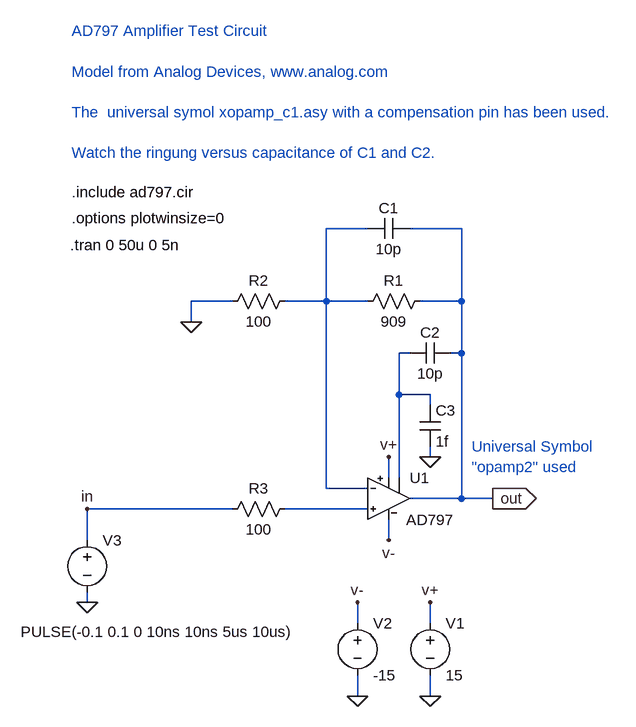
[diagram p0: schematic AD797_test.asc]
AD797_test.asc, the LTspice schematic file:
Version 4
SHEET 1 1200 1172
WIRE 96 192 32 192
WIRE 32 192 32 -96
WIRE 32 -96 96 -96
WIRE 176 -96 240 -96
WIRE 240 -96 240 -16
WIRE -112 224 -336 224
WIRE -32 -96 32 -96
WIRE -336 272 -336 224
WIRE 32 -96 32 -208
WIRE 32 -208 96 -208
WIRE 160 -208 240 -208
WIRE 240 -208 240 -96
WIRE 80 480 80 512
WIRE 128 144 128 176
WIRE 160 208 240 208
WIRE 96 224 -32 224
WIRE 240 208 288 208
WIRE 192 480 192 512
WIRE 128 240 128 272
WIRE 80 400 80 368
WIRE 192 400 192 368
WIRE -336 368 -336 352
WIRE 144 176 144 48
WIRE 144 -16 160 -16
WIRE 224 -16 240 -16
WIRE 240 -16 240 208
WIRE -176 -64 -176 -96
WIRE -176 -96 -112 -96
WIRE 192 144 192 128
WIRE 192 64 192 48
WIRE 192 48 144 48
WIRE 144 48 144 -16
FLAG 192 512 0
FLAG -176 -64 0
FLAG -336 368 0
FLAG 288 208 out
IOPIN 288 208 Out
FLAG 80 512 0
FLAG -336 224 in
FLAG 128 144 v+
FLAG 128 272 v-
FLAG 80 368 v-
FLAG 192 368 v+
FLAG 192 144 0
SYMBOL voltage 192 384 R0
WINDOW 123 0 0 Left 0
WINDOW 39 0 0 Left 0
SYMATTR InstName V1
SYMATTR Value 15
SYMBOL voltage 80 384 R0
WINDOW 123 0 0 Left 0
WINDOW 39 0 0 Left 0
SYMATTR InstName V2
SYMATTR Value -15
SYMBOL res -16 -112 R90
WINDOW 0 0 56 VBottom 0
WINDOW 3 32 56 VTop 0
SYMATTR InstName R2
SYMATTR Value 100
SYMBOL voltage -336 256 R0
WINDOW 3 -102 157 Left 0
WINDOW 123 0 0 Left 0
WINDOW 39 0 0 Left 0
SYMATTR Value PULSE(-0.1 0.1 0 10ns 10ns 5us 10us)
SYMATTR InstName V3
SYMBOL cap 160 -224 R90
WINDOW 0 0 32 VBottom 0
WINDOW 3 32 32 VTop 0
SYMATTR InstName C1
SYMATTR Value 10p
SYMBOL res 192 -112 R90
WINDOW 0 0 56 VBottom 0
WINDOW 3 32 56 VTop 0
SYMATTR InstName R1
SYMATTR Value 909
SYMBOL res -128 240 R270
WINDOW 0 32 56 VTop 0
WINDOW 3 0 56 VBottom 0
SYMATTR InstName R3
SYMATTR Value 100
SYMBOL cap 160 0 R270
WINDOW 0 32 32 VTop 0
WINDOW 3 0 32 VBottom 0
SYMATTR InstName C2
SYMATTR Value 10p
SYMBOL xopamp_c1 128 144 R0
SYMATTR InstName U1
SYMATTR Value AD797
SYMBOL cap 176 64 R0
SYMATTR InstName C3
SYMATTR Value 1f
TEXT -362 -182 Left 0 !.tran 0 50u 0 5n
TEXT 256 128 Left 0 ;Universal Symbol \n"opamp2" used
TEXT -360 -264 Left 0 !.include ad797.cir
TEXT -360 -224 Left 0 !.options plotwinsize=0
TEXT -360 -512 Left 0 ;AD797 Amplifier Test Circuit\n \nModel from Analog Devices, www.analog.com\n \nThe  universal symol xopamp_c1.asy with a compensation pin has been used.\n \nWatch the ringung versus capacitance of C1 and C2.

The netlist it stands for:
* AD797_test.asc
V1 v+ 0 15
V2 v- 0 -15
R2 N001 0 100
V3 in 0 PULSE(-0.1 0.1 0 10ns 10ns 5us 10us)
C1 out N001 10p
R1 out N001 909
R3 in N002 100
C2 N003 out 10p
XU1 N002 N001 v+ v- out N003 AD797  ; pins In+ In- V+ V- OUT COMP
C3 N003 0 1f
.tran 0 50u 0 5n
* Universal Symbol
* "opamp2" used
.include ad797.cir
.options plotwinsize=0
* AD797 Amplifier Test Circuit
* Model from Analog Devices, www.analog.com
* The  universal symol xopamp_c1.asy with a compensation pin has been used.
* Watch the ringung versus capacitance of C1 and C2.
.backanno
.end